# Altium schematic sheet HUMI.SchDoc
size A4
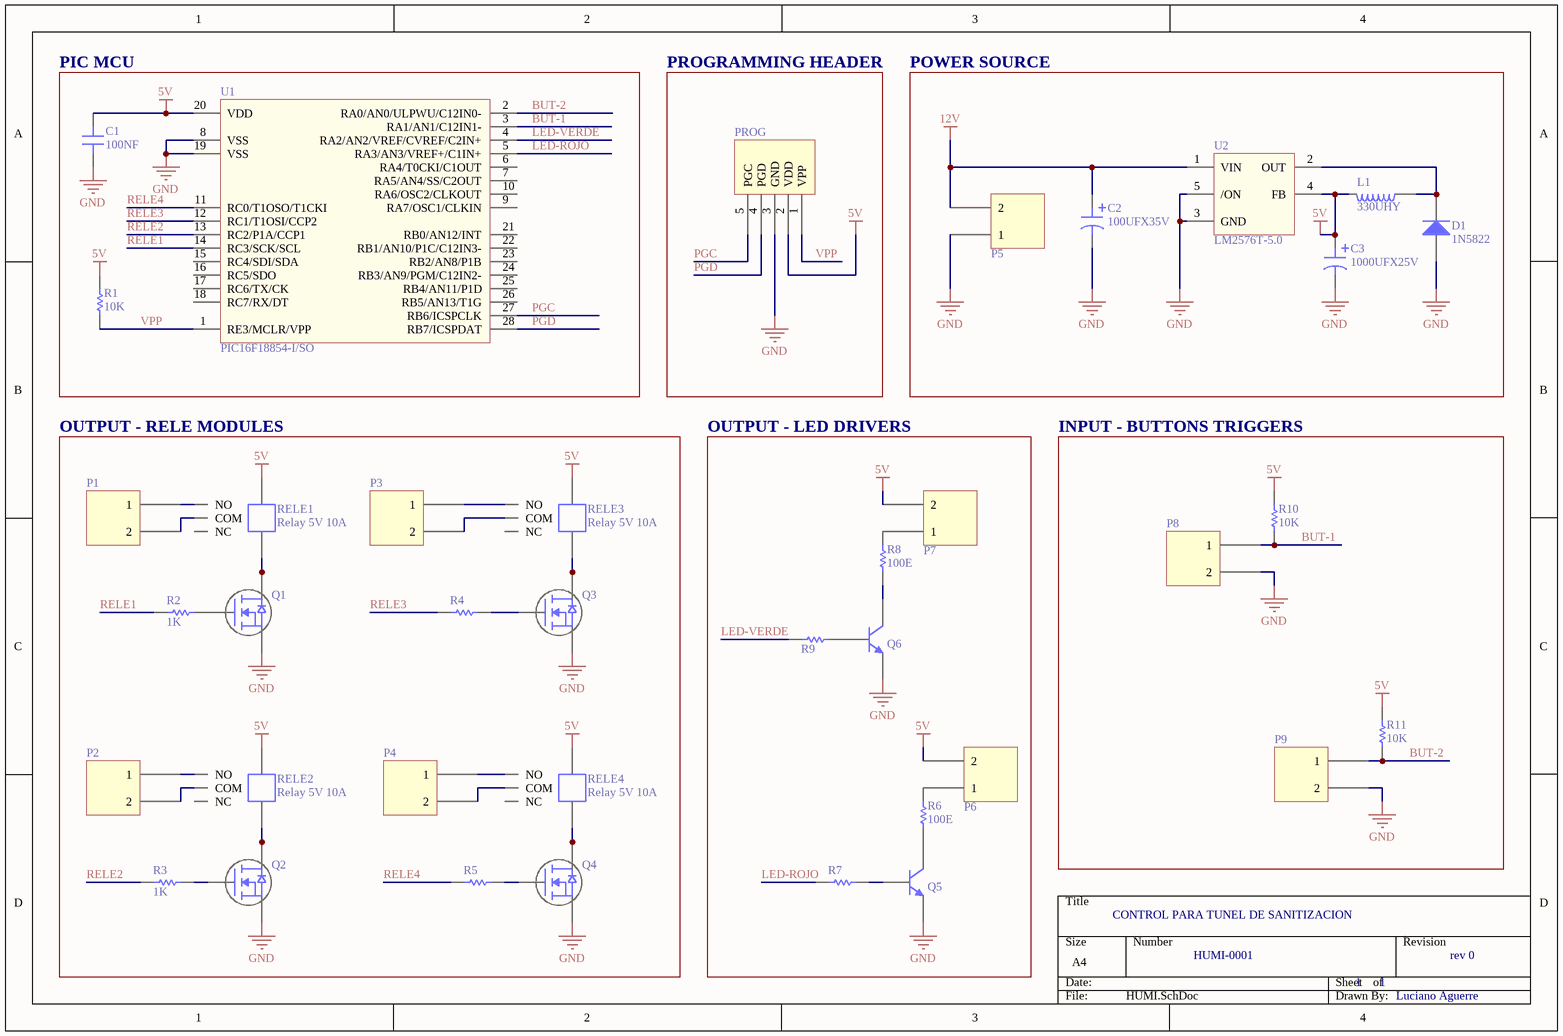
[diagram p0: HUMI.SchDoc]

## Parts
C1  100NF  [CAP.SMD.0805]
C2  100UFX35V  [CAP-ELEC-8X11]
C3  1000UFX25V  [CAP-ELEC-12.5X20]
D1  1N5822  [Diode 1N5822]
L1  330UHY  [Inductor Radial DR1213]
P1  BORNE 2P P=5MM 1.5MM2 15A AZUL XY301V-2P  [CON-BOR-X2-5MM]  (value not drawn)
P2  BORNE 2P P=5MM 1.5MM2 15A AZUL XY301V-2P  [CON-BOR-X2-5MM]  (value not drawn)
P3  BORNE 2P P=5MM 1.5MM2 15A AZUL XY301V-2P  [CON-BOR-X2-5MM]  (value not drawn)
P4  BORNE 2P P=5MM 1.5MM2 15A AZUL XY301V-2P  [CON-BOR-X2-5MM]  (value not drawn)
P5  BORNE 2P P=5MM 1.5MM2 15A AZUL XY301V-2P  [CON-BOR-X2-5MM]  (value not drawn)
P6  CONECTOR PWXXS MA-02 VERTICAL P=3.96MM PW02S  [CONECTOR PWXXS MA-02 VERTICAL P=3.96MM]  (value not drawn)
P7  CONECTOR PWXXS MA-02 VERTICAL P=3.96MM PW02S  [CONECTOR PWXXS MA-02 VERTICAL P=3.96MM]  (value not drawn)
P8  CONECTOR PWXXS MA-02 VERTICAL P=3.96MM PW02S  [CONECTOR PWXXS MA-02 VERTICAL P=3.96MM]  (value not drawn)
P9  CONECTOR PWXXS MA-02 VERTICAL P=3.96MM PW02S  [CONECTOR PWXXS MA-02 VERTICAL P=3.96MM]  (value not drawn)
PROG  In-Serial Circuit Programmer Header  [PIC ICSP]  (value not drawn)
Q1  Transistor MOSFET N IRFD110  [TRA-IRFD110]  (value not drawn)
Q2  Transistor MOSFET N IRFD110  [TRA-IRFD110]  (value not drawn)
Q3  Transistor MOSFET N IRFD110  [TRA-IRFD110]  (value not drawn)
Q4  Transistor MOSFET N IRFD110  [TRA-IRFD110]  (value not drawn)
Q5  BC817-40 TRA.NPN 45V0.5A 0.25W SOT23  [NPN.SMD.SOT23]  (value not drawn)
Q6  BC817-40 TRA.NPN 45V0.5A 0.25W SOT23  [NPN.SMD.SOT23]  (value not drawn)
R1  10K  [RES.SMD.103]
R2  1K  [RES.SMD.102]
R3  1K  [RES.SMD.102]
R4  1K 5% 0805 1/8W RES.SMD  [RES.SMD.102]  (value not drawn)
R5  1K 5% 0805 1/8W RES.SMD  [RES.SMD.102]  (value not drawn)
R6  100E  [RES.SMD.101]
R7  1K 5% 0805 1/8W RES.SMD  [RES.SMD.102]  (value not drawn)
R8  100E  [RES.SMD.101]
R9  1K 5% 0805 1/8W RES.SMD  [RES.SMD.102]  (value not drawn)
R10  10K  [RES.SMD.103]
R11  10K  [RES.SMD.103]
RELE1  Relay 5V 10A  [VAR-RELE-5V10A]
RELE2  Relay 5V 10A  [VAR-RELE-5V10A]
RELE3  Relay 5V 10A  [VAR-RELE-5V10A]
RELE4  Relay 5V 10A  [VAR-RELE-5V10A]
U1  PIC16F18854-I/SO  [SOIC-SO28]
U2  LM2576T-5.0  [LM2576T-5.0]

## Blocks framed on the sheet
PIC MCU: C1 R1 U1
PROGRAMMING HEADER: PROG
POWER SOURCE: C2 C3 D1 L1 P5 U2
OUTPUT - RELE MODULES: P1-P4 Q1-Q4 R2-R5 RELE1-RELE4
OUTPUT - LED DRIVERS: P6 P7 Q5 Q6 R6-R9
INPUT - BUTTONS TRIGGERS: P8 P9 R10 R11

## Nets
5V: C1.2 C3.1 L1.1 P6.2 P7.2 PROG.2(VDD) R1.2 R10.2 R11.2 RELE1.2 RELE2.2 RELE3.2 RELE4.2 U1.20(VDD) U2.4(FB)
12V: C2.1 P5.2 U2.1(VIN)
GND: C1.1 C2.2 C3.2 D1.A P5.1 P8.2 P9.2 PROG.3(GND) Q1.4 Q2.4 Q3.4 Q4.4 Q5.2(E) Q6.2(E) U1.8(VSS) U1.19(VSS) U2.3(GND) U2.5(/ON)
BUT-1: P8.1 R10.1 U1.3(RA1/AN1/C12IN1-)
BUT-2: P9.1 R11.1 U1.2(RA0/AN0/ULPWU/C12IN0-)
LED-ROJO: R7.1 U1.5(RA3/AN3/VREF+/C1IN+)
LED-VERDE: R9.1 U1.4(RA2/AN2/VREF/CVREF/C2IN+)
PGC: PROG.5(PGC) U1.27(RB6/ICSPCLK)
PGD: PROG.4(PGD) U1.28(RB7/ICSPDAT)
RELE1: R2.1 U1.14(RC3/SCK/SCL)
RELE2: R3.1 U1.13(RC2/P1A/CCP1)
RELE3: R4.1 U1.12(RC1/T1OSI/CCP2)
RELE4: R5.1 U1.11(RC0/T1OSO/T1CKI)
VPP: PROG.1(VPP) R1.1 U1.1(RE3/MCLR/VPP)
NetD1_K: D1.K L1.2 U2.2(OUT)
NetP1_1: P1.1 RELE1.4(NO)
NetP1_2: P1.2 RELE1.3(COM)
NetP2_1: P2.1 RELE2.4(NO)
NetP2_2: P2.2 RELE2.3(COM)
NetP3_1: P3.1 RELE3.4(NO)
NetP3_2: P3.2 RELE3.3(COM)
NetP4_1: P4.1 RELE4.4(NO)
NetP4_2: P4.2 RELE4.3(COM)
NetP6_1: P6.1 R6.2
NetP7_1: P7.1 R8.2
NetQ1_1: Q1.1 Q1.2 RELE1.1
NetQ1_3: Q1.3 R2.2
NetQ2_1: Q2.1 Q2.2 RELE2.1
NetQ2_3: Q2.3 R3.2
NetQ3_1: Q3.1 Q3.2 RELE3.1
NetQ3_3: Q3.3 R4.2
NetQ4_1: Q4.1 Q4.2 RELE4.1
NetQ4_3: Q4.3 R5.2
NetQ5_1: Q5.1(B) R7.2
NetQ5_3: Q5.3(C) R6.1
NetQ6_1: Q6.1(B) R9.2
NetQ6_3: Q6.3(C) R8.1

Not connected (* = marked no-connect by the designer): RELE1 5(NC); RELE2 5(NC); RELE3 5(NC); RELE4 5(NC); U1 6(RA4/T0CKI/C1OUT) 7(RA5/AN4/SS/C2OUT) 9(RA7/OSC1/CLKIN) 10(RA6/OSC2/CLKOUT) 15(RC4/SDI/SDA) 16(RC5/SDO) 17(RC6/TX/CK) 18(RC7/RX/DT) 21(RB0/AN12/INT) 22(RB1/AN10/P1C/C12IN3-) 23(RB2/AN8/P1B) 24(RB3/AN9/PGM/C12IN2-) 25(RB4/AN11/P1D) 26(RB5/AN13/T1G)

## Notes on the sheet
- CONTROL PARA TUNEL DE SANITIZACION
- HUMI-0001
- 1      1
- rev 0
- Luciano Aguerre

## Library data of the parts
C1 = Capacitor 100NFX50V X7R 10% CER.MULT. SMD 0805: 100NFX50V X7R 10% CER.MULT. SMD 0805; COD. ELEMON: CA3279774; COD. FV: CE.CAP.0008
C2 = Capacitor Electrolitico 100UFX35V 85°C 8x11 ELE.RAD AISHI: 100UFX35V 85°C 8x11 ELE.RAD AISHI; COD. ELEMON: CA3609372; COD. FV: CE.CAP.0009
C3 = Capacitor Electrolitico 1000UFX25V 85°C 12.5X20 ELE.RAD AISHI: 1000UFX25V 85°C 12.5X20 ELE.RAD AISHI; COD. ELEMON: CA3609291; COD. FV: CE.CAP.0010
D1 = Diodo Schottky 1N5822 3A 40V: COD. FV: CE.DIO.0002
L1 = Inductor Radial 330UHY 0.3R 1.4A RAD. 15.5X15.5MM: 330UHY 0.3R 1.4A RAD. 15.5X15.5MM; COD. ELEMON: FI1537220; COD. FV: CE.IND.0002
P1-P5 = BORNE 2P P=5MM 1.5MM2 15A AZUL XY301V-2P: COD. ELEMON: BO5812000
P6-P9 = CONECTOR PWXXS MA-02 VERTICAL P=3.96MM PW02S: COD. ELEMON: CO5052000; COD. FV: CE.CON.0012
PROG = In-Serial Circuit Programmer Header: COD. ELEMON: CO4900906; COD. FV: CE.CON.0017
Q1-Q4 = Transistor MOSFET N IRFD110: COD. FV: CE.TRA.0003
Q5 Q6 = Transistor BC817-40 TRA.NPN 45V0.5A 0.25W SOT23: COD. ELEMON: TR1723020; COD. FV: CE.TRA.0002
R1 R10 R11 = Resistencia 10K 5% 0805 1/8W: 10K 5% 0805 1/8W RES.SMD; COD. ELEMON: RS3896245; COD. FV: CE.RES.0014
R2 R3 = Resistencia 1K 5% 0805 1/8W: 1K 5% 0805 1/8W RES.SMD; COD. ELEMON: RS3896185; COD. FV: CE.RES.0012
R4 R5 R7 R9 = Resistencia 1K 5% 0805 1/8W: COD. ELEMON: RS3896185; COD. FV: CE.RES.0012
R6 R8 = Resistencia 100E 5% 0805 1/8W: 100E 5% 0805 1/8W RES.SMD; COD. ELEMON: RS3896125; COD. FV: CE.RES.0011
RELE1-RELE4 = VAR-RELE-5V Relay simple inversor 5V 10A: Relay simple inversor 5V 10A; COD. SYC: NT73-05
U1 = PIC16F18854-I/SO 28 SOIC 7KB Flash, 512B RAM, 256B EE, 10b ADC2, DAC, Comp, PWM: COD. FV: CE.MIC.0003; COD. ELEMON: MI2986745
U2 = LM2576T-5.0 TO220 3A.STEP.DOWN.VOLT.REG.: COD. ELEMON: CI2707258H; COD. FV: CE.SEM.0002